# EAGLE design Main Modular Board V1.0 (EAGLE 8.7.1)
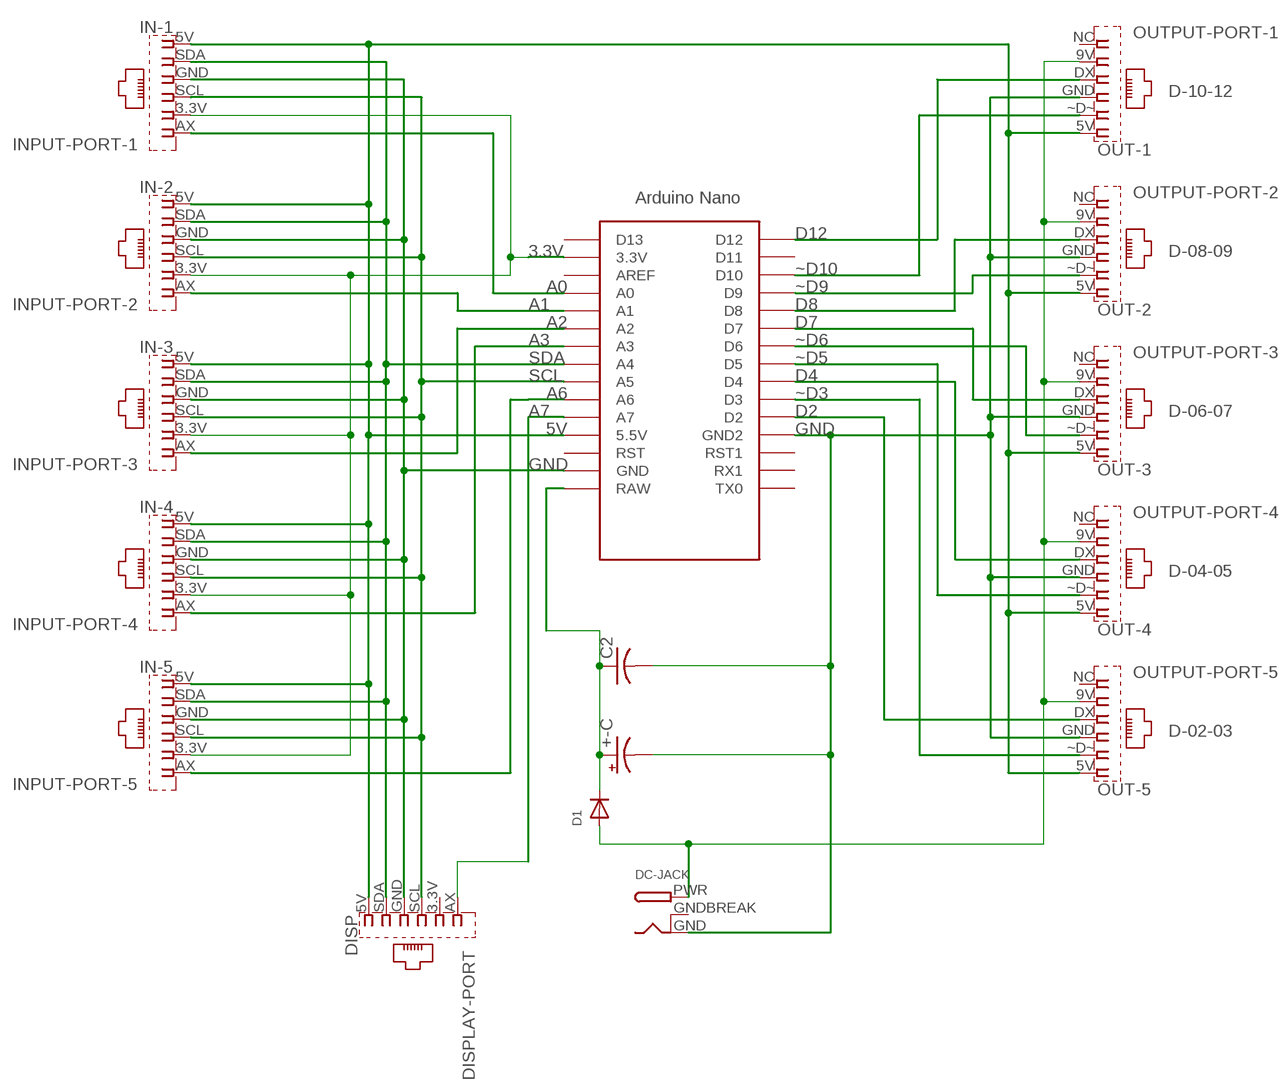
[diagram p0: schematic, sheet 1]

## Parts
+-C  CPOL-USE2.5-6  [E2,5-6]
C2  C-US025-025X050  [C025-025X050]
D1  DIODEDO-1N4148  [DO-1N4148]
DC-JACK  DCBARRELPTH  [DCJACK_2MM_PTH]
DISP  DISPLAY-PORT  ELEMENTORY-RJ11INPUT-BOARD  [ELEMENTORY-IN-BRD]
IN-1  INPUT-PORT-1  ELEMENTORY-RJ11INPUT-BOARD  [ELEMENTORY-IN-BRD]
IN-2  INPUT-PORT-2  ELEMENTORY-RJ11INPUT-BOARD  [ELEMENTORY-IN-BRD]
IN-3  INPUT-PORT-3  ELEMENTORY-RJ11INPUT-BOARD  [ELEMENTORY-IN-BRD]
IN-4  INPUT-PORT-4  ELEMENTORY-RJ11INPUT-BOARD  [ELEMENTORY-IN-BRD]
IN-5  INPUT-PORT-5  ELEMENTORY-RJ11INPUT-BOARD  [ELEMENTORY-IN-BRD]
OUT-1  OUTPUT-PORT-1  ELEMENTORY-RJ11OUTPUT-BOARD  [ELEMENTORY-OUT-BRD]
OUT-2  OUTPUT-PORT-2  ELEMENTORY-RJ11OUTPUT-BOARD  [ELEMENTORY-OUT-BRD]
OUT-3  OUTPUT-PORT-3  ELEMENTORY-RJ11OUTPUT-BOARD  [ELEMENTORY-OUT-BRD]
OUT-4  OUTPUT-PORT-4  ELEMENTORY-RJ11OUTPUT-BOARD  [ELEMENTORY-OUT-BRD]
OUT-5  OUTPUT-PORT-5  ELEMENTORY-RJ11OUTPUT-BOARD  [ELEMENTORY-OUT-BRD]
U$1  NANO  [NANO]

## Nets
3.3V: IN-1.3.3V IN-2.3.3V IN-3.3.3V IN-4.3.3V IN-5.3.3V U$1.3.3V
5V: DISP.5V IN-1.5V IN-2.5V IN-3.5V IN-4.5V IN-5.5V OUT-1.5V OUT-2.5V OUT-3.5V OUT-4.5V OUT-5.5V U$1.5V(5.5V)
9V: D1.A DC-JACK.PWR OUT-1.9V OUT-2.9V OUT-3.9V OUT-4.9V OUT-5.9V
A0: IN-1.AX U$1.A0
A1: IN-2.AX U$1.A1
A2: IN-3.AX U$1.A2
A3: IN-4.AX U$1.A3
A6: IN-5.AX U$1.A6
A7: DISP.AX U$1.A7
D2: OUT-5.DX U$1.D2
D4: OUT-4.DX U$1.D4
D7: OUT-3.DX U$1.D7
D8: OUT-2.DX U$1.D8
D12: OUT-1.DX U$1.D12
GND: +-C.- C2.2 DC-JACK.GND DISP.GND IN-1.GND IN-2.GND IN-3.GND IN-4.GND IN-5.GND OUT-1.GND OUT-2.GND OUT-3.GND OUT-4.GND OUT-5.GND U$1.GND U$1.GND1(GND2)
N$1: +-C.+ C2.1 D1.C U$1.RAW
SCL: DISP.SCL IN-1.SCL IN-2.SCL IN-3.SCL IN-4.SCL IN-5.SCL U$1.A5
SDA: DISP.SDA IN-1.SDA IN-2.SDA IN-3.SDA IN-4.SDA IN-5.SDA U$1.A4
~D3: OUT-5.~D~ U$1.D3
~D5: OUT-4.~D~ U$1.D5
~D6: OUT-3.~D~ U$1.D6
~D9: OUT-2.~D~ U$1.D9
~D10: OUT-1.~D~ U$1.D10
Unconnected: DISP.3.3V OUT-1.NC OUT-2.NC OUT-3.NC OUT-4.NC OUT-5.NC U$1.AREF U$1.D11 U$1.D13 U$1.ICSP1 U$1.ICSP2 U$1.ICSP3 U$1.ICSP4 U$1.ICSP5 U$1.ICSP6 U$1.RST U$1.RST1 U$1.RX1 U$1.TX0

## Notes on the sheet
- D-10-12
- D-08-09
- D-06-07
- D-04-05
- D-02-03

## Power pins joined to a net without a drawn wire
GNDBREAK: DC-JACK.GNDBREAK

## Library data of the parts
+-C = adafruit:CPOL-US: POLARIZED CAPACITOR, American symbol
C2 = adafruit:C-US: CAPACITOR, American symbol
D1 = adafruit:DIODE: Diode SMADIODE - SMA Surface Mount Package 20V 1A Schottky Diode Digikey: 641-1014-6-ND DO-1N4148 - Through Hole Small Current Diode SOD-123 20V 1 A (.5mV Vf) Schottky Diode - Digikey: MBRX120TPMSCT-ND SOD-323 10V 570mA (.38mV Vf, 3ns) Schottky Diode - Digikey: ZLLS410CT-ND SOD-523 30V 30mA Schottky Diode (RB751S-40TE61) - Digikey: RB751S-40TE61CT-ND SOT23-R/W - SOT23 Package (R = Solder Paste/Reflow Ovens, W = Hand-Soldering) BAT54Film 40V 300mA - Digikey: 497-7162-1-ND
DC-JACK = adafruit:DCBARREL: 2.0mm DC Barrel Jack DCJACK_2MM_PTH - Through Hole Jack (4UConnector: 05537)
DISP IN-1-IN-5 OUT-1-OUT-5 = ELEMENTORY-RJ11-V1:ELEMENTORY-RJ11: RJ11 6 connects Source: YH-55-10.pdf
U$1 = Elementory Nano:NANO: Arduino Nano

## Board
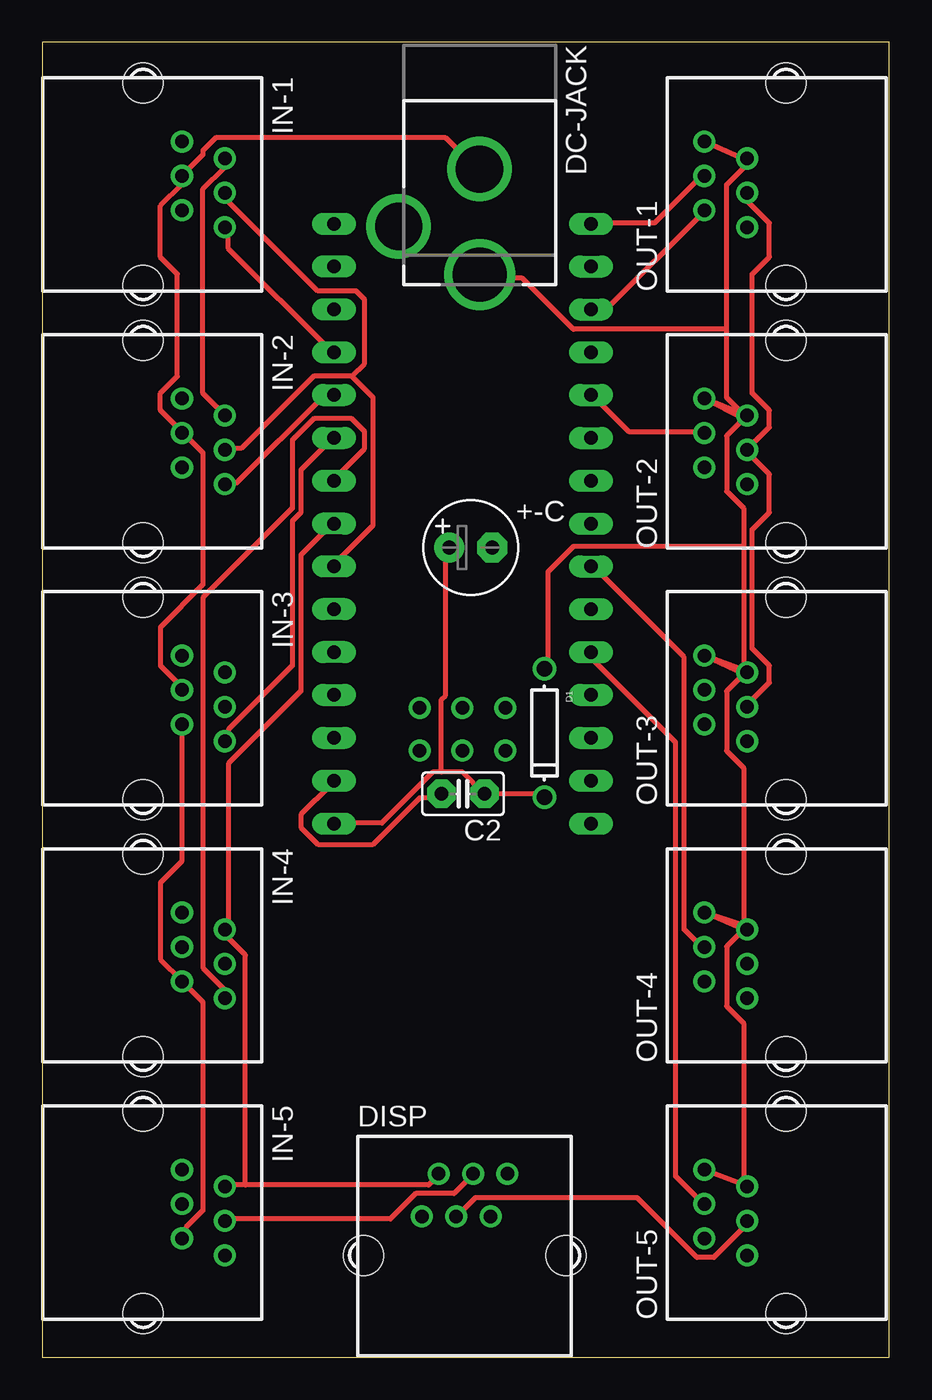
[diagram p1: board, top side]
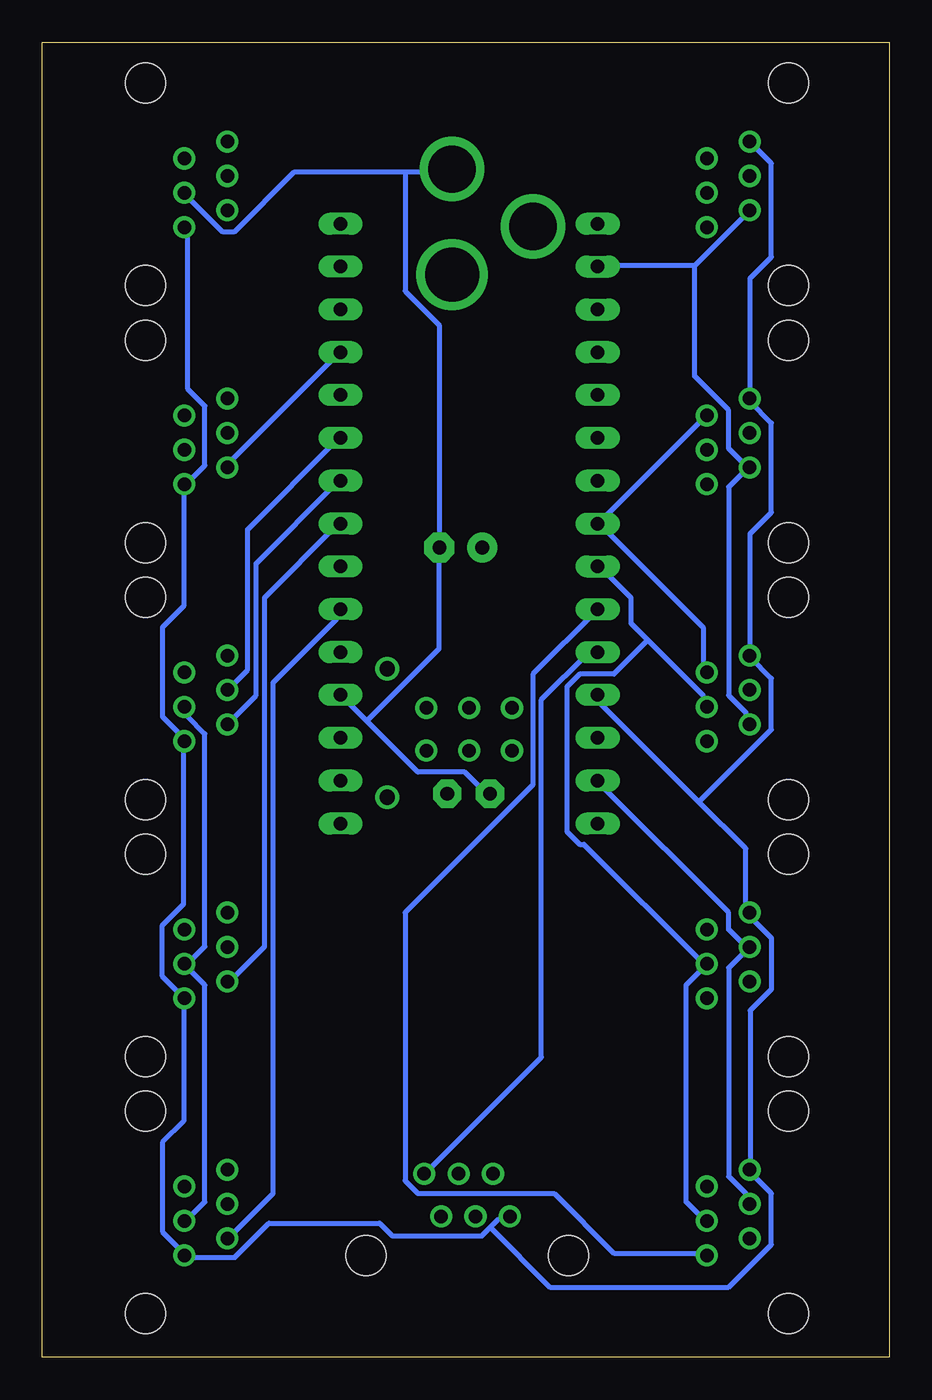
[diagram p2: board, bottom side, seen from below]

Size 50.22 x 77.98 mm. Coordinates in mm from the lower left corner, seen from the top.
Outline: 0,0 50.22,0 50.22,77.98 0,77.98 0,0
Copper layers (1*16): Top 0.035mm / dielectric 1.5mm / Bottom 0.035mm
Design rules "default *": minimum track width 12mil, minimum drill 0.35mm, track to track 0.2mm, track to pad 0.275mm, pad to pad 0.2mm, via to via 0.2mm, smd to smd 6mil, copper to edge 0.5mm, drill to drill 0.2mm, minimum pad ring 10mil, minimum via ring 8mil, stop-mask expansion 4mil, vias tented up to drill 0mil, thermal gap 10mil

### Footprints (pad centres in the part's own frame; a part is rotated, then mirrored left to right if it is on the bottom)
E2,5-6 = drill 0.813 pad 1.778: + -1.27,0 | drill 0.813 pad 1.778 octagon: - 1.27,0
C025-025X050 = drill 0.813 pad 1.676 octagon: 1 -1.27,0; 2 1.27,0
DO-1N4148 = drill 0.9: A -3.81,0; C 3.81,0
DCJACK_2MM_PTH = drill 2.8: GND 0,7.35; GNDBREAK 4.8,10.75 | drill 3.2: PWR 0,13.6
ELEMENTORY-IN-BRD = drill 0.8 pad 1.3: 3.3V 1.54,2.3; 5V -2.54,2.3; AX 2.54,4.84; GND -0.5,2.3; SCL 0.5,4.84; SDA -1.54,4.84 | hole 2.36: -6,0; 6,0
ELEMENTORY-OUT-BRD = drill 0.8 pad 1.3: 5V -2.54,2.3; 9V 2.54,4.84; DX 0.5,4.84; GND -0.5,2.3; NC 1.54,2.3; ~D~ -1.54,4.84 | hole 2.36: -6,0; 6,0
NANO = drill 0.8 long: 3.3V -10.16,24.13; 5V -10.16,-1.27; A0 -10.16,19.05; A1 -10.16,16.51; A2 -10.16,13.97; A3 -10.16,11.43; A4 -10.16,8.89; A5 -10.16,6.35; A6 -10.16,3.81; A7 -10.16,1.27; AREF -10.16,21.59; D2 5.08,1.27; D3 5.08,3.81; D4 5.08,6.35; D5 5.08,8.89; D6 5.08,11.43; D7 5.08,13.97; D8 5.08,16.51; D9 5.08,19.05; D10 5.08,21.59; D11 5.08,24.13; D12 5.08,26.67; D13 -10.16,26.67; GND -10.16,-6.35; GND1 5.08,-1.27; RAW -10.16,-8.89; RST -10.16,-3.81; RST1 5.08,-3.81; RX1 5.08,-6.35; TX0 5.08,-8.89 | drill 0.8: ICSP1 -5.08,-4.572; ICSP2 -5.08,-2.032; ICSP3 -2.54,-4.572; ICSP4 -2.54,-2.032; ICSP5 0,-4.572; ICSP6 0,-2.032

### Placement (x,y rotation side)
+-C  25.4,48.02 0 top
C2  24.95,33.42 180 top
D1  29.77,37.02 270 top
DC-JACK  25.93,77.81 180 top
DISP  25.04,6.05 0 top
IN-1  5.99,69.55 270 top
IN-2  5.99,54.31 270 top
IN-3  5.99,39.07 270 top
IN-4  5.99,23.83 270 top
IN-5  5.99,8.59 270 top
OUT-1  44.09,69.55 90 top
OUT-2  44.09,54.31 90 top
OUT-3  44.09,39.07 90 top
OUT-4  44.09,23.83 90 top
OUT-5  44.09,8.59 90 top
U$1  27.45,40.55 0 top

### Tracks (layer width: path | path; a pad name or v marks a point on that pad's centre or on a via)
3.3V
  Top 0.305: IN-5.3.3V 8.52,7.19 8.52,7.7 9.53,8.71 9.53,21.07 8.52,22.08 IN-4.3.3V 8.27,22.34 7,23.6 7,28.14 8.27,29.4 8.27,37.48 IN-3.3.3V
  Bottom 0.305: 11.55,64.74 17.1,64.74 U$1.3.3V | 11.55,64.74 8.52,67.77 IN-1.3.3V | IN-3.3.3V 8.52,37.73 8.52,38.24 9.53,39.25 9.53,51.61 8.52,52.62 IN-2.3.3V 8.52,52.88 9.53,53.89 9.53,56.16 11.55,58.18 11.55,64.74
5V
  Bottom 0.305: 11.29,32.94 8.52,30.16 8.52,26.37 IN-4.5V 8.27,26.12 7,24.86 7,21.83 8.27,20.57 8.27,11.23 IN-5.5V 8.27,10.98 7,9.72 7,6.69 9.53,4.16 20.13,4.16 23.66,7.7 | 11.29,32.94 17.1,38.74 17.1,39.25 U$1.5V | 11.29,32.94 7,37.23 7,40.26 8.27,41.52 IN-3.5V 8.27,41.77 8.27,48.84 7,50.1 7,55.4 8.27,56.66 IN-2.5V 8.27,56.92 8.27,63.98 7,65.24 7,70.8 8.27,72.06 IN-1.5V | OUT-1.5V 41.58,66.76 41.58,57.42 40.57,56.41 40.57,52.88 41.58,51.87 OUT-2.5V 41.83,51.61 41.83,44.55 43.1,43.28 43.1,37.98 41.83,36.72 OUT-3.5V 41.83,36.47 41.83,26.88 43.1,25.62 43.1,22.59 41.83,21.33 OUT-4.5V 41.83,21.07 41.83,14.01 43.1,12.75 43.1,7.44 41.83,6.18 OUT-5.5V 41.58,5.93 38.81,5.93 36.79,7.95 30.22,7.95 29.47,7.19 24.17,7.19 23.66,7.7 | 23.66,7.7 23.16,8.2 22.65,8.2 DISP.5V
9V
  Top 0.305: OUT-5.9V 41.58,10.22 41.58,19.81 40.57,20.82 40.57,24.35 41.58,25.37 OUT-4.9V 41.58,25.62 41.58,34.96 40.57,35.97 40.57,39.5 41.58,40.51 OUT-3.9V 41.58,40.76 41.58,48.08 | 41.58,48.08 41.58,50.35 40.57,51.36 40.57,54.64 41.58,55.65 OUT-2.9V 41.58,55.91 40.57,56.92 40.57,60.95 | 40.57,60.95 40.57,69.53 41.58,70.54 41.58,71.05 OUT-1.9V | 41.58,48.08 31.49,48.08 29.97,46.57 29.97,41.01 D1.A | 40.57,60.95 31.49,60.95 28.46,63.98 25.93,63.98 DC-JACK.PWR
A0
  Top 0.305: IN-1.AX 11.04,66.76 11.04,65.75 17.1,59.69 U$1.A0
A1
  Top 0.305: IN-2.AX 11.04,51.87 11.55,51.87 16.59,56.92 17.1,56.92 U$1.A1
A2
  Top 0.305: IN-3.AX 11.04,36.72 11.04,37.23 14.83,41.01 14.83,49.59 15.33,50.1 15.33,52.62 17.1,54.39 U$1.A2
A3
  Top 0.305: IN-4.AX 10.79,21.33 10.79,21.83 9.53,23.09 9.53,45.05 14.83,50.35 14.83,54.39 16.09,55.65 18.36,55.65 19.12,54.9 19.12,53.89 17.35,52.12 U$1.A3
A6
  Bottom 0.305: IN-5.AX 11.04,6.18 16.34,6.18 19.88,9.72 27.95,9.72 28.71,10.47 28.71,26.37 21.14,33.95 21.14,40.51 17.35,44.3 U$1.A6
A7
  Bottom 0.305: U$1.A7 17.35,41.77 17.86,41.77 20.63,38.99 20.63,17.79 27.45,10.98 DISP.AX
D2
  Top 0.305: U$1.D2 32.75,41.77 32.75,41.27 37.54,36.47 37.54,10.73 39.06,9.21 OUT-5.DX
D4
  Top 0.305: U$1.D4 32.75,46.82 38.05,41.52 38.05,25.37 39.06,24.35 OUT-4.DX
D7
  Bottom 0.305: U$1.D7 32.75,54.39 38.05,49.09 38.05,40.76 39.06,39.75 OUT-3.DX
D8
  Top 0.305: OUT-2.DX 39.06,54.9 34.77,54.9 32.75,56.92 U$1.D8
D12
  Top 0.305: U$1.D12 32.75,67.26 36.28,67.26 39.06,70.04 OUT-1.DX
GND
  Top 0.305: C2.2 23.66,33.19 22.4,33.19 19.62,30.41 16.34,30.41 15.33,31.42 15.33,32.18 17.1,33.95 U$1.GND | IN-3.GND 8.27,39.75 7,41.01 7,43.28 9.53,45.81 9.53,53.63 8.52,54.64 IN-2.GND 8.27,54.9 7,56.16 7,57.17 8.01,58.18 8.01,64.23 7,65.24 7,68.27 8.27,69.53 8.27,70.04 IN-1.GND 8.52,70.29 9.53,71.3 9.53,71.55 10.28,72.31 23.91,72.31 25.68,70.54 DC-JACK.GND | DISP.GND 24.67,8.45 25.68,9.46 35.27,9.46 38.81,5.93 39.81,5.93 41.83,7.95 OUT-5.GND | OUT-3.GND 41.83,38.74 43.1,40 43.1,41.01 42.09,42.02 42.09,49.09 43.1,50.1 43.1,52.37 41.83,53.63 OUT-2.GND 41.83,53.89 43.1,55.15 43.1,56.16 42.09,57.17 42.09,64.23 43.1,65.24 43.1,67.26 41.83,68.53 41.83,69.03 OUT-1.GND
  Bottom 0.305: 30.98,37.73 27.95,34.7 25.18,34.7 23.91,33.44 C2.2 | 30.98,37.73 32.5,39.25 U$1.GND1 | 30.98,37.73 26.69,42.02 26.69,47.83 +-C.- 26.69,48.08 26.69,61.21 28.71,63.22 28.71,70.29 | IN-5.GND 8.52,9.21 8.52,9.72 9.53,10.73 9.53,23.09 8.52,24.1 IN-4.GND 8.52,24.35 9.53,25.37 9.53,26.37 17.1,33.95 U$1.GND | OUT-5.GND 41.58,8.2 40.57,9.21 40.57,22.08 41.58,23.09 OUT-4.GND 41.58,23.35 40.57,24.35 40.57,36.98 41.58,37.98 41.58,38.49 OUT-3.GND | 28.71,70.29 35.27,70.29 38.81,66.76 39.56,66.76 41.83,69.03 OUT-1.GND | 28.71,70.29 25.93,70.29 DC-JACK.GND
N$1
  Top 0.305: 23.66,34.7 24.92,34.7 26.19,33.44 C2.1 26.44,33.44 29.72,33.44 D1.C | 23.66,34.7 23.16,34.7 20.13,31.67 17.35,31.67 U$1.RAW | 23.66,34.7 23.66,38.99 23.91,39.25 23.91,47.83 +-C.+
SCL
  Top 0.305: IN-5.SCL 11.04,8.2 20.63,8.2 22.15,9.72 24.42,9.72 25.43,10.73 DISP.SCL | 18.36,58.18 16.09,58.18 11.8,53.89 11.04,53.89 IN-2.SCL | 18.36,58.18 19.62,56.92 19.62,49.34 17.35,47.07 U$1.A5 | 18.36,58.18 19.12,58.93 19.12,62.72 18.61,63.22 16.34,63.22 11.04,68.53 11.04,69.03 IN-1.SCL
  Bottom 0.305: IN-5.SCL 11.04,8.2 12.05,9.21 12.05,22.08 11.04,23.09 IN-4.SCL 11.04,23.35 18.11,30.41 18.36,30.41 19.12,31.17 19.12,39.75 18.36,40.51 16.34,40.51 14.32,42.53 | 14.32,42.53 15.33,43.54 15.33,45.05 17.1,46.82 U$1.A5 | 14.32,42.53 11.04,39.25 11.04,38.74 IN-3.SCL
SDA
  Top 0.305: 12.05,10.22 22.9,10.22 23.41,10.73 DISP.SDA | 12.05,10.22 11.04,10.22 IN-5.SDA | 12.05,10.22 12.05,23.85 11.04,24.86 11.04,25.37 IN-4.SDA 11.04,25.62 11.04,35.21 15.33,39.5 15.33,47.58 17.1,49.34 U$1.A4 | IN-1.SDA 10.79,71.05 10.79,70.54 9.53,69.28 9.53,57.17 10.79,55.91 IN-2.SDA
  Bottom 0.305: IN-3.SDA 11.04,40.76 11.04,43.28 17.1,49.34 U$1.A4 17.1,49.59 11.04,55.65 IN-2.SDA
~D3
  Bottom 0.305: U$1.D3 32.75,44.3 32.75,43.79 36.53,40 36.53,9.72 39.06,7.19 OUT-5.~D~
~D5
  Bottom 0.305: U$1.D5 32.75,49.34 37.04,45.05 37.04,24.35 39.06,22.34 OUT-4.~D~
~D6
  Bottom 0.305: U$1.D6 32.75,51.87 37.54,47.07 37.54,39.25 39.06,37.73 OUT-3.~D~
~D9
  Bottom 0.305: U$1.D9 32.75,59.44 39.31,52.88 OUT-2.~D~
~D10
  Top 0.305: U$1.D10 32.75,62.22 33.5,62.22 39.06,67.77 OUT-1.~D~

### Text on the board
200bmp: HYDROGEN